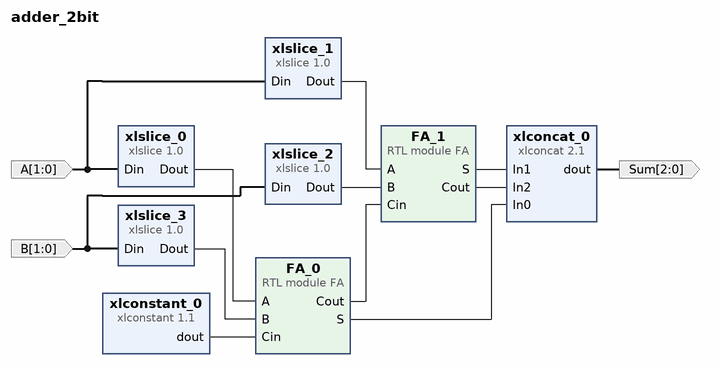
[diagram p0: block diagram of the top level]
# Vivado block design adder_2bit, xc7a100tcsg324-2L, Vivado 2020.1
create_bd_design adder_2bit

create_bd_port -dir I -from 1 -to 0 A
create_bd_port -dir I -from 1 -to 0 B
create_bd_port -dir O -from 2 -to 0 Sum

create_bd_cell -type module -reference FA FA_0
create_bd_cell -type module -reference FA FA_1
create_bd_cell -type ip -vlnv xilinx.com:ip:xlslice:1.0 xlslice_0
set_property -dict {CONFIG.DIN_WIDTH 2} [get_bd_cells xlslice_0]
create_bd_cell -type ip -vlnv xilinx.com:ip:xlslice:1.0 xlslice_1
set_property -dict {CONFIG.DIN_WIDTH 2} [get_bd_cells xlslice_1]
create_bd_cell -type ip -vlnv xilinx.com:ip:xlslice:1.0 xlslice_2
set_property -dict {CONFIG.DIN_WIDTH 2} [get_bd_cells xlslice_2]
create_bd_cell -type ip -vlnv xilinx.com:ip:xlslice:1.0 xlslice_3
set_property -dict {CONFIG.DIN_WIDTH 2} [get_bd_cells xlslice_3]
create_bd_cell -type ip -vlnv xilinx.com:ip:xlconstant:1.1 xlconstant_0
set_property -dict {CONFIG.CONST_VAL 0} [get_bd_cells xlconstant_0]
create_bd_cell -type ip -vlnv xilinx.com:ip:xlconcat:2.1 xlconcat_0
set_property -dict {CONFIG.NUM_PORTS 3} [get_bd_cells xlconcat_0]

# ---- connections ----

connect_bd_net [get_bd_pins xlslice_0/Dout] [get_bd_pins FA_0/A]
connect_bd_net [get_bd_pins xlslice_1/Dout] [get_bd_pins FA_1/A]
connect_bd_net [get_bd_pins xlslice_2/Dout] [get_bd_pins FA_1/B]
connect_bd_net [get_bd_pins xlslice_3/Dout] [get_bd_pins FA_0/B]
connect_bd_net [get_bd_ports A] [get_bd_pins xlslice_0/Din] [get_bd_pins xlslice_1/Din]
connect_bd_net [get_bd_ports B] [get_bd_pins xlslice_3/Din] [get_bd_pins xlslice_2/Din]
connect_bd_net [get_bd_pins xlconstant_0/dout] [get_bd_pins FA_0/Cin]
connect_bd_net [get_bd_pins FA_0/Cout] [get_bd_pins FA_1/Cin]
connect_bd_net [get_bd_pins FA_0/S] [get_bd_pins xlconcat_0/In0]
connect_bd_net [get_bd_pins FA_1/S] [get_bd_pins xlconcat_0/In1]
connect_bd_net [get_bd_pins FA_1/Cout] [get_bd_pins xlconcat_0/In2]
connect_bd_net [get_bd_pins xlconcat_0/dout] [get_bd_ports Sum]

validate_bd_design
save_bd_design
